# Altium schematic sheet LTM4625.SchDoc
size A2; SheetNumber: 1; SheetTotal: 1
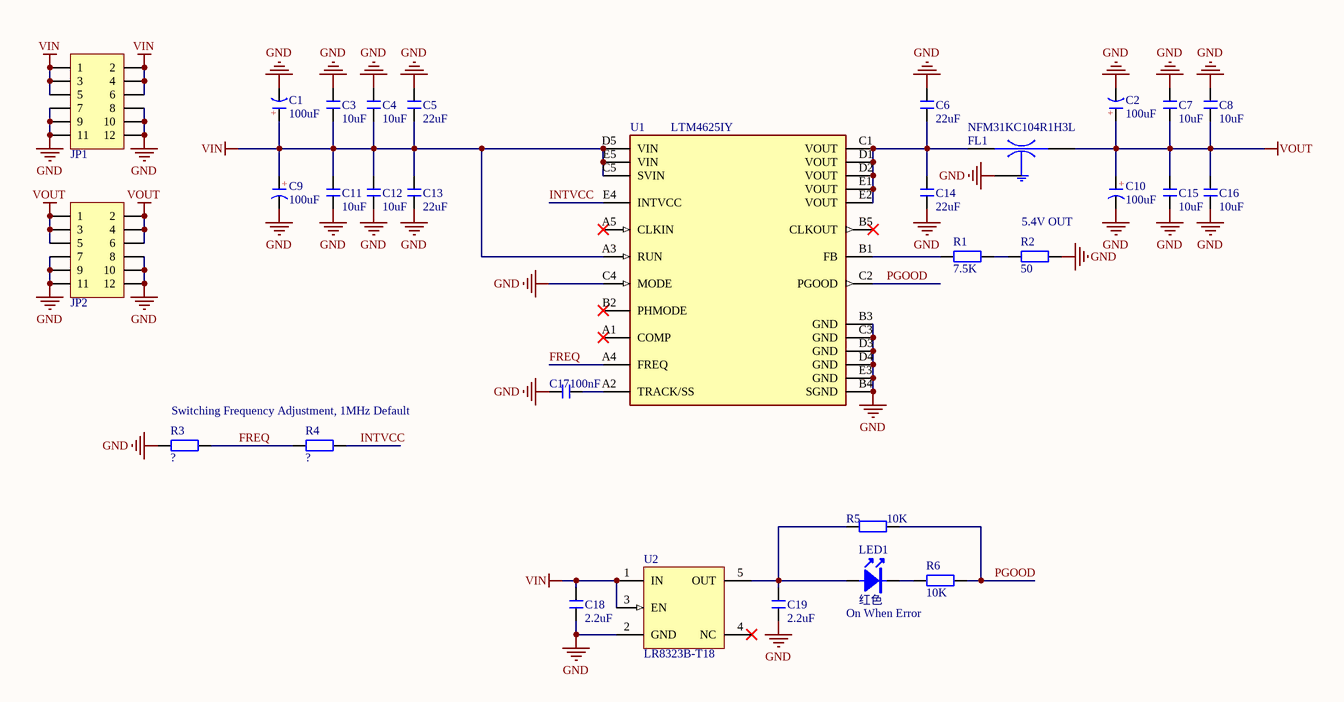
[diagram p0: LTM4625.SchDoc]

## Parts
C1  100uF  [CAP 2.5*6.3*7]
C2  100uF  [CAP 2.5*6.3*7]
C3  10uF  [C 1210_L]
C4  10uF  [C 1210_L]
C5  22uF  [C 1206_L]
C6  22uF  [C 1206_L]
C7  10uF  [C 1210_L]
C8  10uF  [C 1210_L]
C9  100uF  [CAP 2.5*6.3*7]
C10  100uF  [CAP 2.5*6.3*7]
C11  10uF  [C 1210_L]
C12  10uF  [C 1210_L]
C13  22uF  [C 1206_L]
C14  22uF  [C 1206_L]
C15  10uF  [C 1210_L]
C16  10uF  [C 1210_L]
C17  100nF  [C 0603_L]
C18  2.2uF  [C 0603_L]
C19  2.2uF  [C 0603_L]
FL1  NFM31KC104R1H3L  [FIL_NFM31KC104R1H3L]
JP1  Header 6X2  [HDR2.54-LI-2x6P]  (value not drawn)
JP2  Header 6X2  [HDR2.54-LI-2x6P]  (value not drawn)
LED1  红色  [LED 0603R]
R1  7.5K  [R 0603_L]
R2  50  [R 0603_L]
R3  ?  [R 0603_L]
R4  ?  [R 0603_L]
R5  10K  [R 0603_L]
R6  10K  [R 0603_L]
U1  LTM4625IY  [FP-BGA-25-05-08-1905-MFG]
U2  LR8323B-T18  [DBV0005A_L]

## Nets
GND: C1.2(K) C2.2(K) C3.2 C4.2 C5.2 C6.2 C7.2 C8.2 C9.2(K) C10.2(K) C11.2 C12.2 C13.2 C14.2 C15.2 C16.2 C17.1 C18.1 C19.1 FL1.2(GND) JP1.7 JP1.8 JP1.9 JP1.10 JP1.11 JP1.12 JP2.7 JP2.8 JP2.9 JP2.10 JP2.11 JP2.12 R2.2 R3.1 U1.B3(GND) U1.B4(SGND) U1.C3(GND) U1.C4(MODE) U1.D3(GND) U1.D4(GND) U1.E3(GND) U2.2(GND)
VIN: C1.1(A) C3.1 C4.1 C5.1 C9.1(A) C11.1 C12.1 C13.1 C18.2 JP1.1 JP1.2 JP1.3 JP1.4 JP1.5 JP1.6 U1.A3(RUN) U1.C5(SVIN) U1.D5(VIN) U1.E5(VIN) U2.1(IN) U2.3(EN)
VOUT: C2.1(A) C7.1 C8.1 C10.1(A) C15.1 C16.1 FL1.3(OUT) JP2.1 JP2.2 JP2.3 JP2.4 JP2.5 JP2.6
FREQ: R3.2 R4.1 U1.A4(FREQ)
INTVCC: R4.2 U1.E4(INTVCC)
PGOOD: R5.1 R6.2 U1.C2(PGOOD)
NetC6_1: C6.1 C14.1 FL1.1(IN) U1.C1(VOUT) U1.D1(VOUT) U1.D2(VOUT) U1.E1(VOUT) U1.E2(VOUT)
NetC17_2: C17.2 U1.A2(TRACK/SS)
NetC19_2: C19.2 LED1.1(A) R5.2 U2.5(OUT)
NetLED1_2: LED1.2(K) R6.1
NetR1_1: R1.1 U1.B1(FB)
NetR1_2: R1.2 R2.1

Not connected (* = marked no-connect by the designer): U1 A1(COMP)* A5(CLKIN)* B2(PHMODE)* B5(CLKOUT)*; U2 4(NC)*

## Notes on the sheet
- 5.4V OUT
- Switching Frequency Adjustment, 1MHz Default
- On When Error
- (in symbol CE) +

## Library data of the parts
C1 C2 C9 C10 = CE: 直插电解电容; 淘宝ID: 小糖豆的小窝窝; BOM名称: 直插电解电容; 下单链接: https://item.taobao.com/item.htm?ft=t&id=613637044352
C3-C8 C11-C19 = C: 贴片电容; 淘宝ID: 小糖豆的小窝窝; BOM名称: 贴片电容; 下单链接: https://item.taobao.com/item.htm?ft=t&id=613637044352
FL1 = NFM31KC104R1H3L: SMD Capacitor with Capacitance: 0.10uF Tol. 20%. Rated Voltage: 50Vdc; MF: Murata; Package: NONSTANDARD; MP: NFM31KC104R1H3L; Price: None; Availability: Unavailable; Value: *; SnapEDA_Link: https://www.snapeda.com/parts/NFM31KC104R1H3L/Murata/view-part/4377127/?ref=snap
JP1 JP2 = Header  6X2: 6*2P接插件; 淘宝ID: 小糖豆的小窝窝; BOM名称: 6*2P接插件; 下单链接: https://item.taobao.com/item.htm?ft=t&id=613637044352
LED1 = LED-SMD: 贴片LED; 淘宝ID: 小糖豆的小窝窝; BOM名称: 贴片LED; 下单链接: https://item.taobao.com/item.htm?ft=t&id=613637044352
R1-R6 = R: 贴片电阻; 淘宝ID: 小糖豆的小窝窝; BOM名称: 贴片电阻; 下单链接: https://item.taobao.com/item.htm?ft=t&id=613637044352
U1 = LTM4625IY: DC DC CONVERTER 0.6-5.5V; Output Current: 5A; Output Voltage: 5.5V; Max Input Voltage: 20V; Number of Outputs: 1; Min Input Voltage: 4V; Efficiency: 91%; Series: µModule®; Max Output Current: 5A; Number of Pins: 25; Height: 0.07inch; Case/Package: BGA; Mount: Surface Mount; RoHS Compliant: No; Width: 0.25inch; Voltage - Output 1: 5.5V; Features: UVLO; Length: 0.25inch; Max Operating Temperature: 125°C; Min Operating Temperature: -40°C; Packaging: Tray
U2 = LR8323B-T18: None